# EAGLE schematic VET6_POD (EAGLE 4.13)
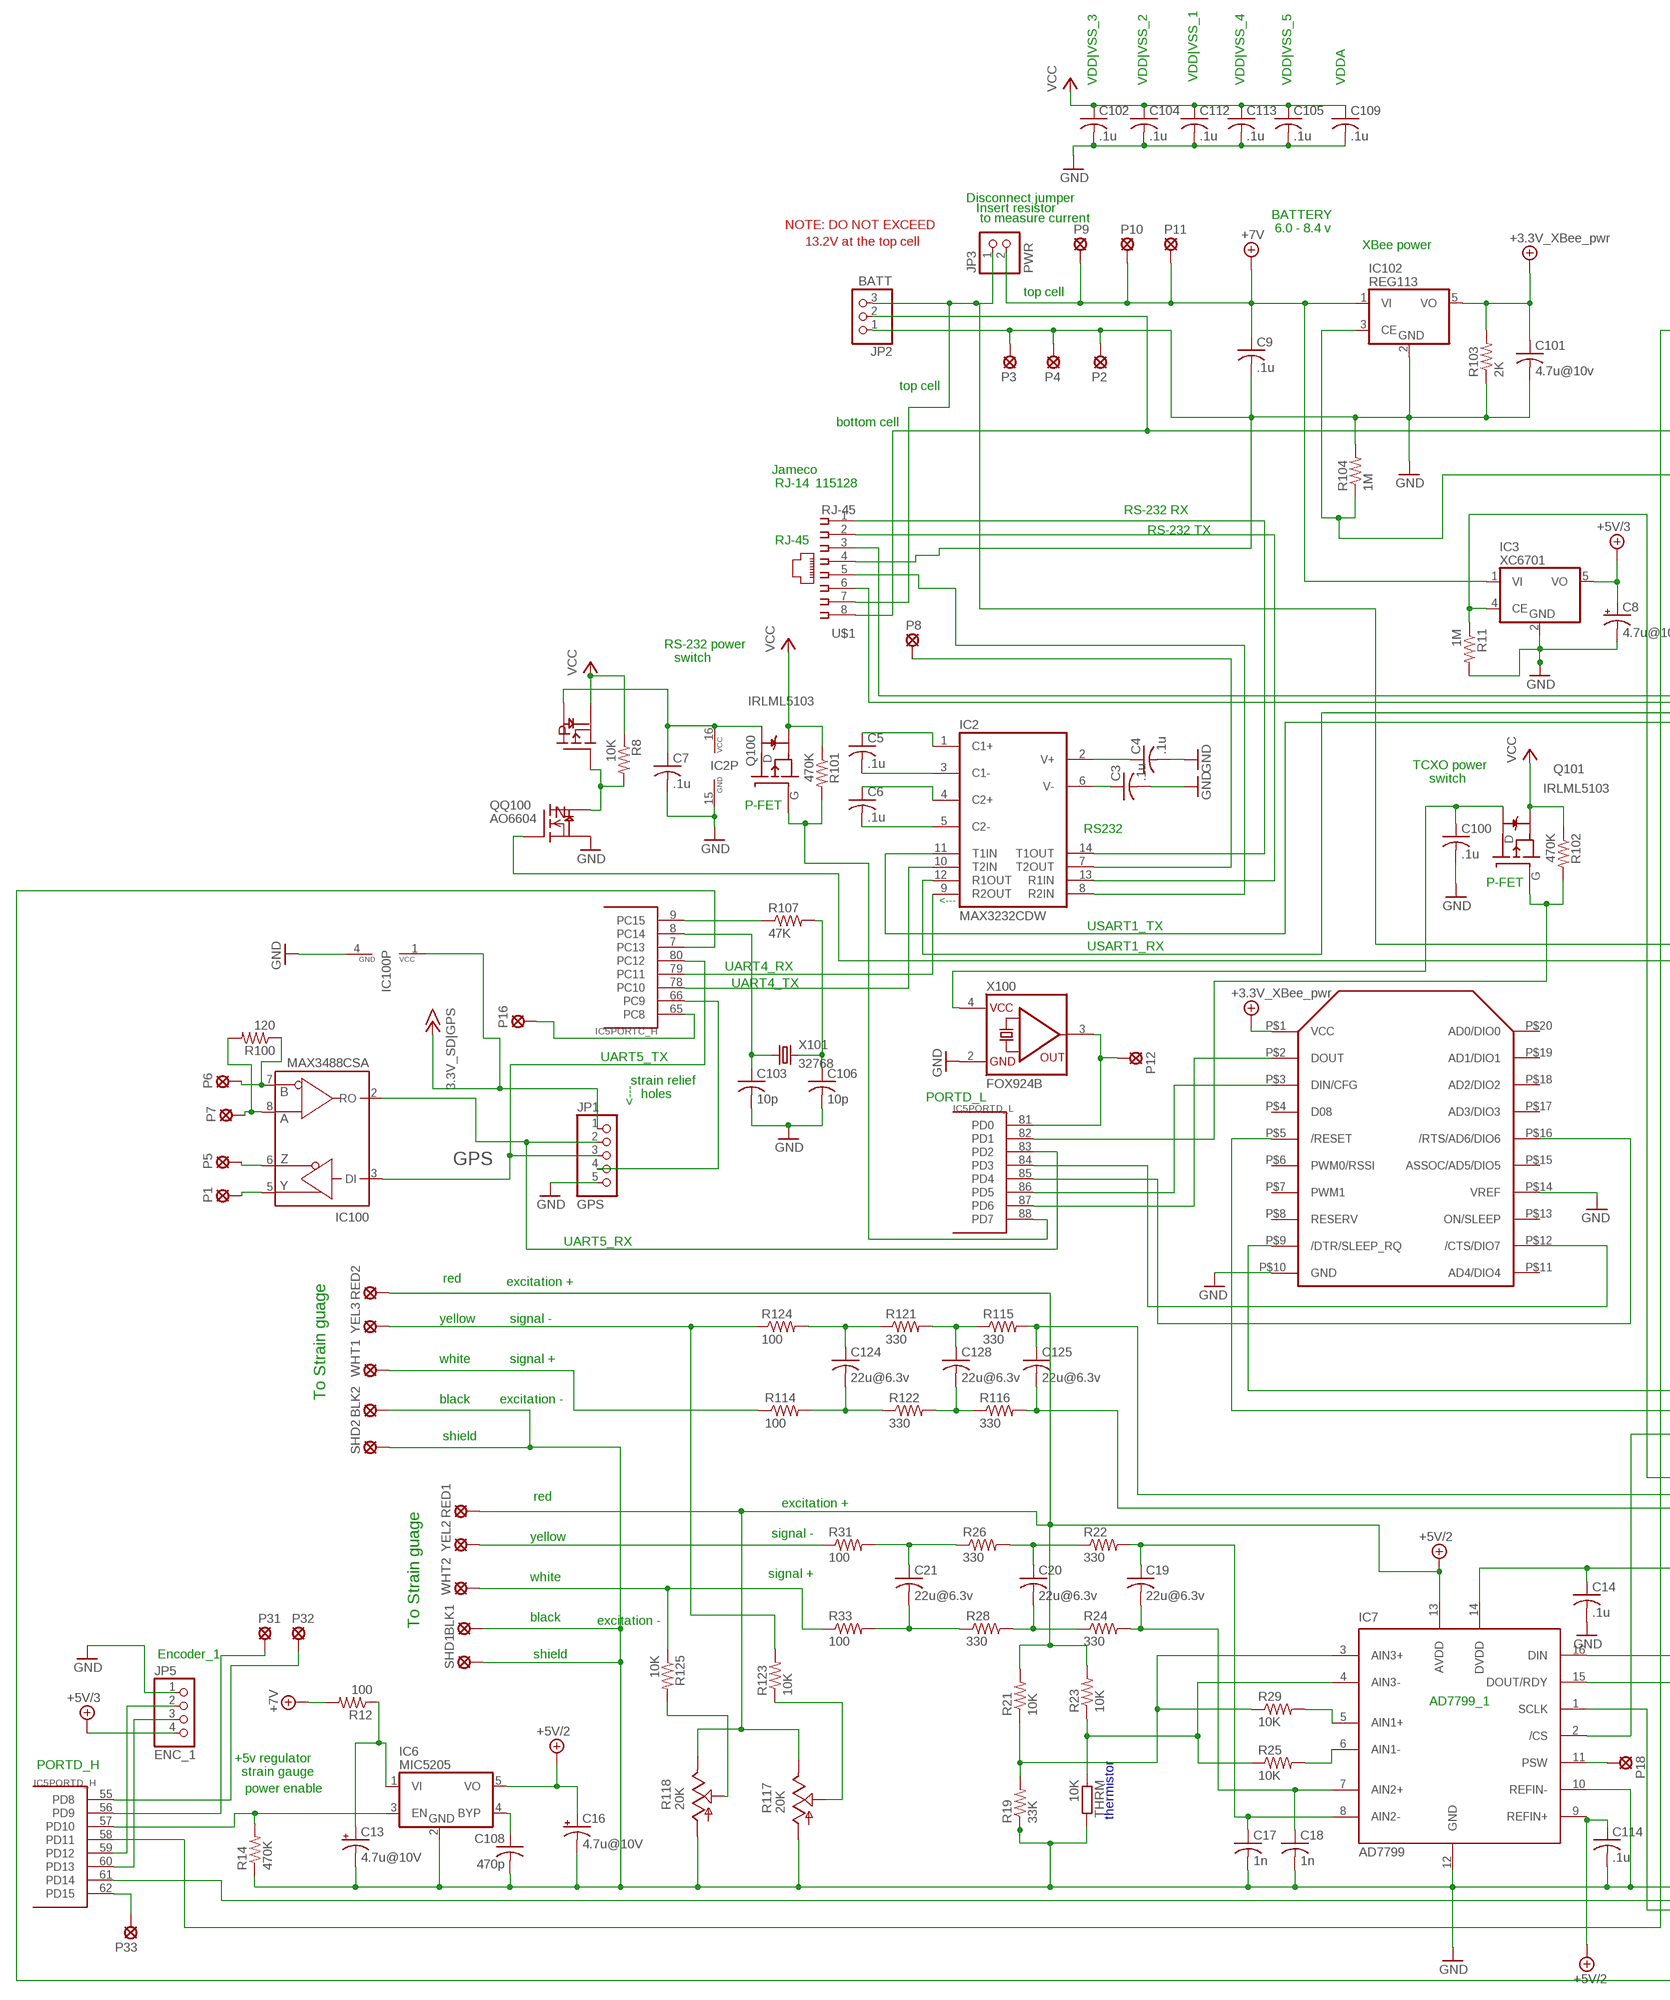
[diagram p0: schematic, sheet 1, part 1 of 2]
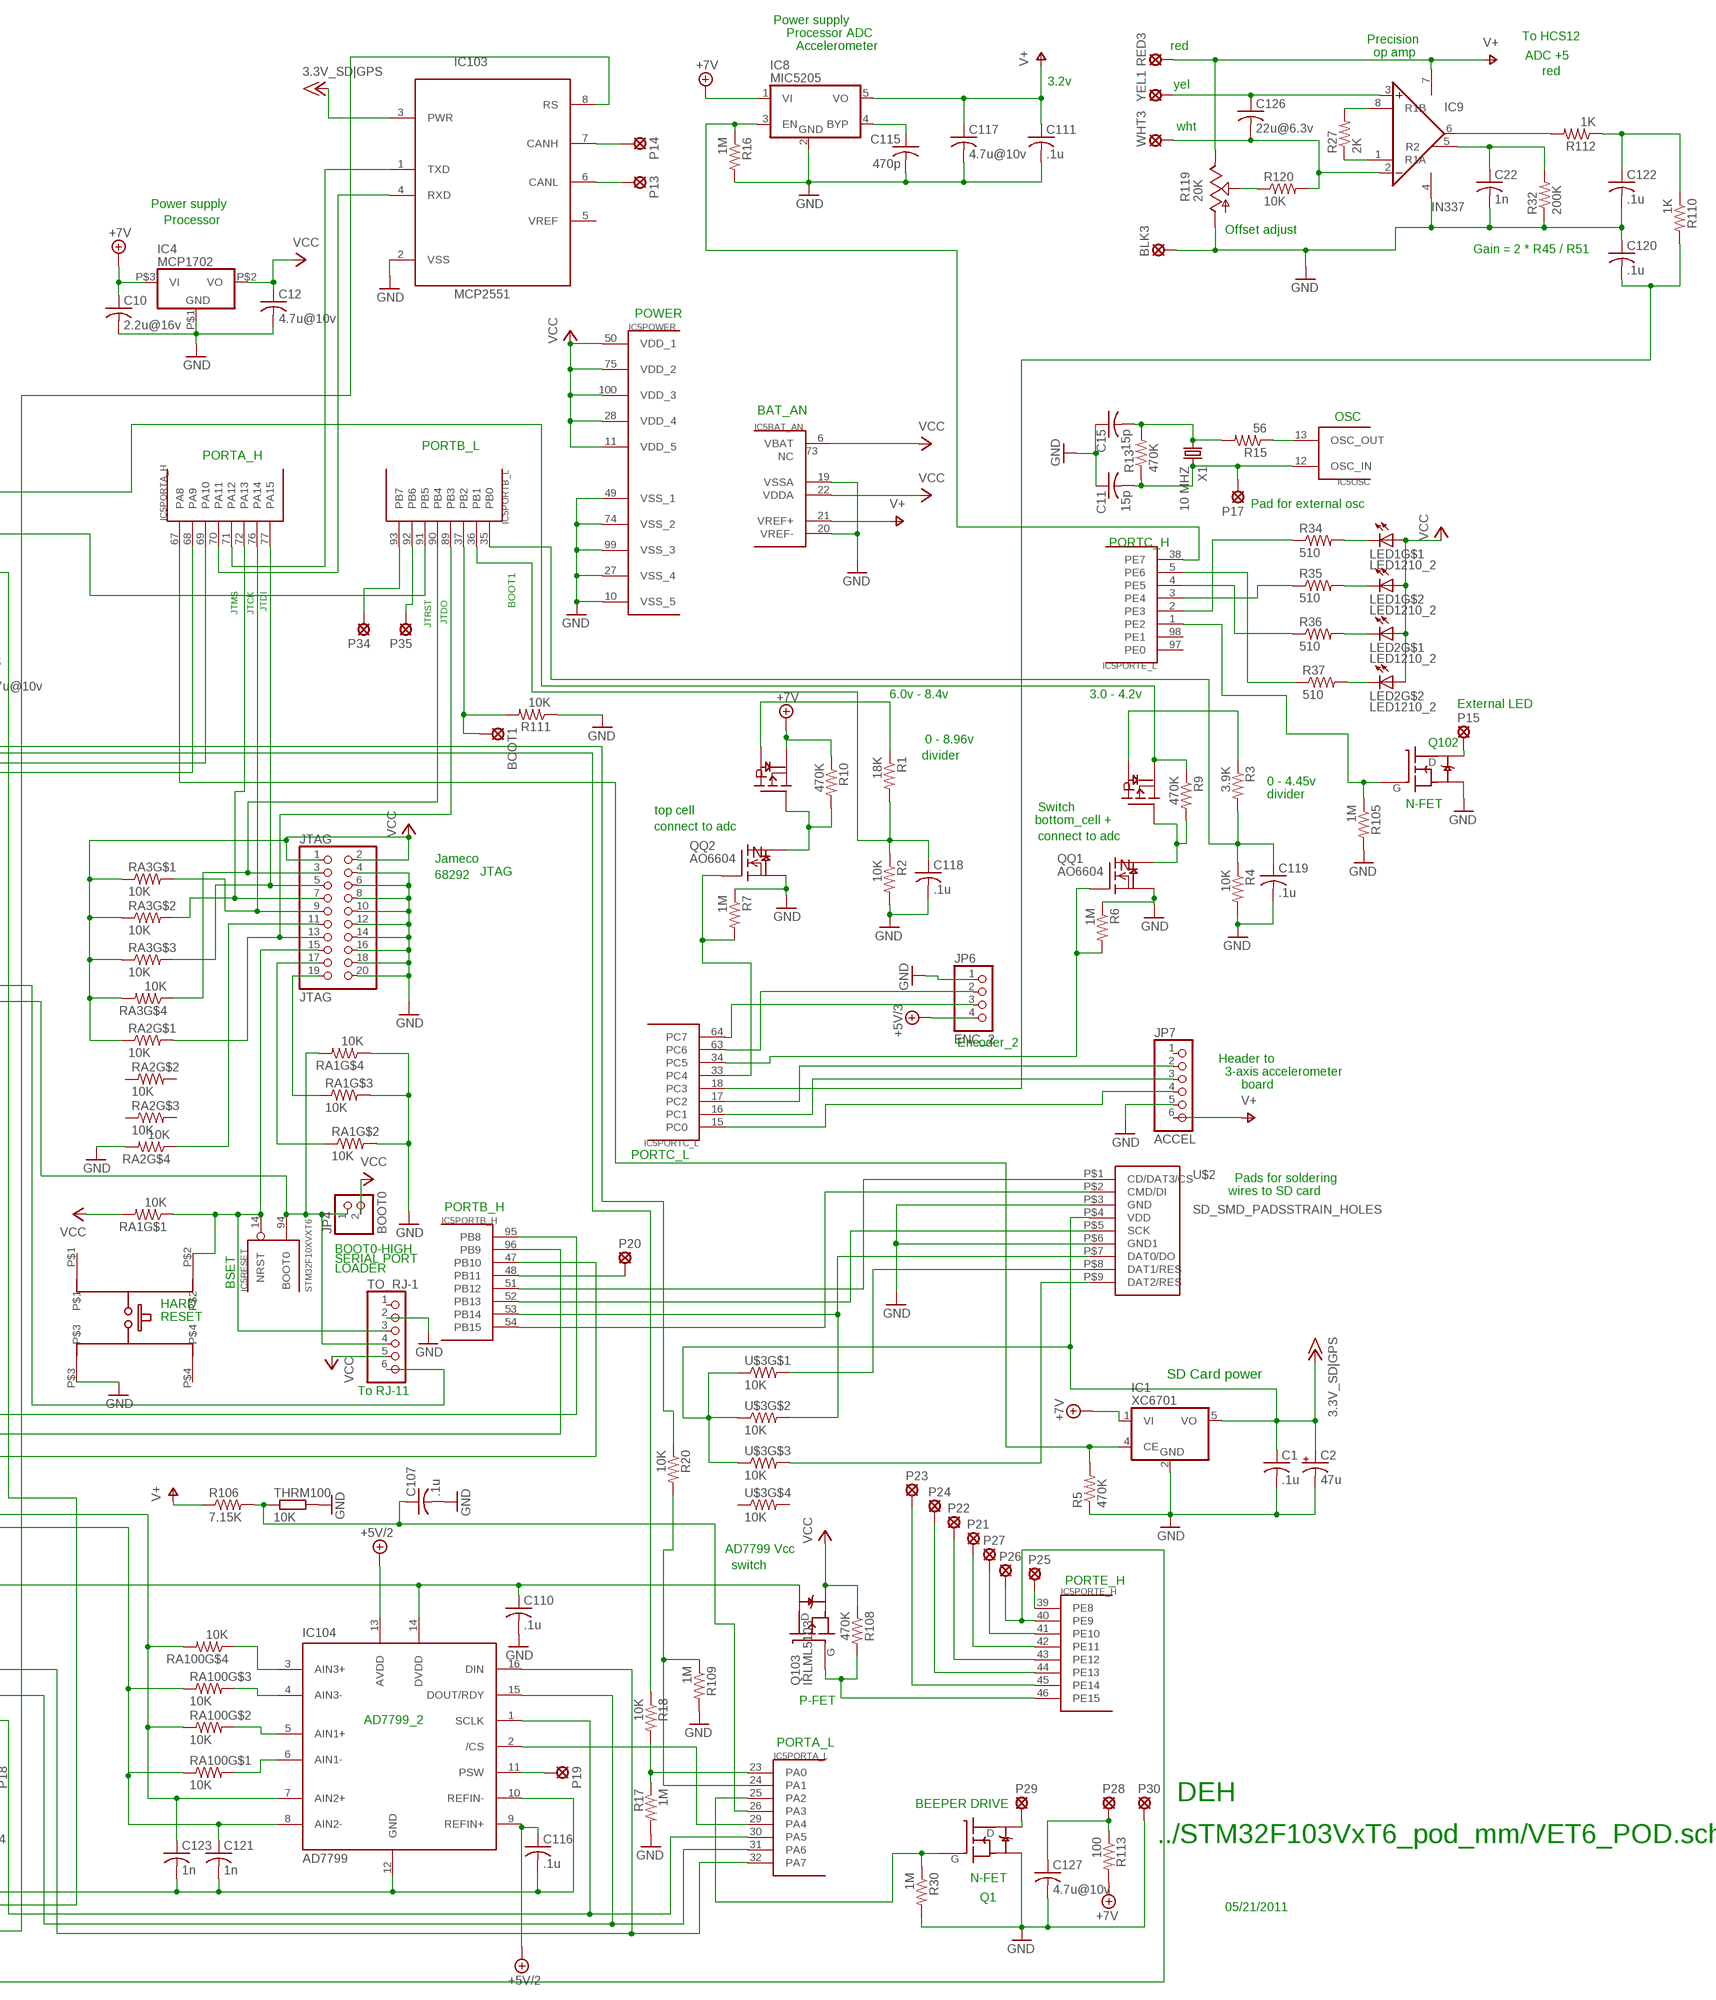
[diagram p1: schematic, sheet 1, part 2 of 2]

## Parts
BLK1  SOLPAD060  [SOLPAD060]
BLK2  SOLPAD060  [SOLPAD060]
BLK3  SOLPAD060  [SOLPAD060]
BOOT1  BOOT1  SOLDPAD028  [SOLPAD028]
C1  .1u  C-USC0805  [C0805]
C2  47u  CPOL-USCT3528  [CT3528]
C3  .1u  C-USC0805  [C0805]
C4  .1u  C-USC0805  [C0805]
C5  .1u  C-USC0805  [C0805]
C6  .1u  C-USC0805  [C0805]
C7  .1u  C-USC0805  [C0805]
C8  4.7u@10v  CPOL-USCT3528  [CT3528]
C9  .1u  C-USC0805  [C0805]
C10  2.2u@16v  C-USC0603  [C0603]
C11  15p  C-USC0603  [C0603]
C12  4.7u@10v  C-USC0805  [C0805]
C13  4.7u@10V  CPOL-USCT3528  [CT3528]
C14  .1u  C-USC0805  [C0805]
C15  15p  C-USC0603  [C0603]
C16  4.7u@10V  CPOL-USCT3528  [CT3528]
C17  1n  C-USC0603  [C0603]
C18  1n  C-USC0603  [C0603]
C19  22u@6.3v  C-USC1206  [C1206]
C20  22u@6.3v  C-USC1206  [C1206]
C21  22u@6.3v  C-USC1206  [C1206]
C22  1n  C-USC0603  [C0603]
C100  .1u  C-USC0805  [C0805]
C101  4.7u@10v  C-USC1206  [C1206]
C102  .1u  C-USC0805  [C0805]
C103  10p  C-USC0603  [C0603]
C104  .1u  C-USC0805  [C0805]
C105  .1u  C-USC0805  [C0805]
C106  10p  C-USC0603  [C0603]
C107  .1u  C-USC0805  [C0805]
C108  470p  C-USC0603  [C0603]
C109  .1u  C-USC0805  [C0805]
C110  .1u  C-USC0805  [C0805]
C111  .1u  C-USC0805  [C0805]
C112  .1u  C-USC0805  [C0805]
C113  .1u  C-USC0805  [C0805]
C114  .1u  C-USC0603  [C0603]
C115  470p  C-USC0603  [C0603]
C116  .1u  C-USC0603  [C0603]
C117  4.7u@10v  C-USC1206  [C1206]
C118  .1u  C-USC0805  [C0805]
C119  .1u  C-USC0805  [C0805]
C120  .1u  C-USC0805  [C0805]
C121  1n  C-USC0603  [C0603]
C122  .1u  C-USC0805  [C0805]
C123  1n  C-USC0603  [C0603]
C124  22u@6.3v  C-USC1206  [C1206]
C125  22u@6.3v  C-USC1206  [C1206]
C126  22u@6.3v  C-USC1206  [C1206]
C127  4.7u@10v  C-USC1206  [C1206]
C128  22u@6.3v  C-USC1206  [C1206]
IC1  XC6701  [SOT-25]
IC2  MAX3232CDW  MAX232ECWE  [SO16L]
IC3  XC6701  [SOT-25]
IC4  MCP1702  [SOT-23A]
IC5  STM32F10XVXT6  [TQFP100]
IC6  MIC5205  [SOT-25]
IC7  AD7799  [TSSPO16]
IC8  MIC5205  [SOT-25]
IC9  IN337  [SO08]
IC100  MAX3488CSA  MAX488CSA  [SO08]
IC101  XBEE-PROSMD  [XBEE_PRO_SMD]
IC102  REG113  [SOT-25]
IC103  MCP2551  [SO-08]
IC104  AD7799  [TSSPO16]
JP1  GPS  PINHD-1X5  [1X05]
JP2  BATT  PINHD-1X3  [1X03]
JP3  PWR  PINHD-1X2  [1X02]
JP4  BOOT0  PINHD-1X2  [1X02]
JP5  ENC_1  PINHD-1X4  [1X04]
JP6  ENC_2  PINHD-1X4  [1X04]
JP7  ACCEL  PINHD-1X6  [1X06]
JTAG  JTAG  PINHD-2X10_KEYED  [2X10_KEYED]
LED1  LED1210_2  [CHIP2LED_1210]
LED2  LED1210_2  [CHIP2LED_1210]
P1  P9  SOLPAD035  [SOLDPAD035]
P2  GND  SOLPAD035  [SOLDPAD035]
P3  GND  SOLPAD035  [SOLDPAD035]
P4  GND  SOLPAD035  [SOLDPAD035]
P5  P9  SOLPAD035  [SOLDPAD035]
P6  P9  SOLPAD035  [SOLDPAD035]
P7  P9  SOLPAD035  [SOLDPAD035]
P8  P9  SOLPAD035  [SOLDPAD035]
P9  +7V  SOLPAD035  [SOLDPAD035]
P10  +7V  SOLPAD035  [SOLDPAD035]
P11  +7V  SOLPAD035  [SOLDPAD035]
P12  PD0  SOLPAD035  [SOLDPAD035]
P13  +7V  SOLPAD035  [SOLDPAD035]
P14  +7V  SOLPAD035  [SOLDPAD035]
P15  PE2_FET  SOLPAD035  [SOLDPAD035]
P16  PC8  SOLPAD035  [SOLDPAD035]
P17  OSC_IN  SOLPAD035  [SOLDPAD035]
P18  PSW_1  SOLPAD035  [SOLDPAD035]
P19  PSW_2  SOLPAD035  [SOLDPAD035]
P20  SOLDPAD028  [SOLPAD028]
P21  PE11  SOLDPAD028  [SOLPAD028]
P22  PE12  SOLDPAD028  [SOLPAD028]
P23  PE14  SOLDPAD028  [SOLPAD028]
P24  PE13  SOLDPAD028  [SOLPAD028]
P25  PE8  SOLDPAD028  [SOLPAD028]
P26  PE9  SOLDPAD028  [SOLPAD028]
P27  PE10  SOLDPAD028  [SOLPAD028]
P28  +7V  SOLPAD035  [SOLDPAD035]
P29  BEEP  SOLPAD035  [SOLDPAD035]
P30  +7V  SOLPAD035  [SOLDPAD035]
P31  SOLPAD028  SOLDPAD028  [SOLPAD028]
P32  SOLPAD028  SOLDPAD028  [SOLPAD028]
P33  SOLPAD0.6  [SOLPAD0.6]
P34  SOLPAD0.6  [SOLPAD0.6]
P35  SOLPAD0.6  [SOLPAD0.6]
Q1  IRLML2060  [SOT-23]
Q100  IRLML5103  [SOT-23]
Q101  IRLML5103  [SOT-23]
Q102  IRLML2060  [SOT-23]
Q103  IRLML5103  [SOT-23]
QQ1  AO6604  [TSOP6]
QQ2  AO6604  [TSOP6]
QQ100  AO6604  [TSOP6]
R1  18K  R-US_M0805  [M0805]
R2  10K  R-US_M0805  [M0805]
R3  3.9K  R-US_M0805  [M0805]
R4  10K  R-US_M0805  [M0805]
R5  470K  R-US_R0603  [R0603]
R6  1M  R-US_R0603  [R0603]
R7  1M  R-US_R0603  [R0603]
R8  10K  R-US_R0603  [R0603]
R9  470K  R-US_R0603  [R0603]
R10  470K  R-US_R0603  [R0603]
R11  1M  R-US_R0603  [R0603]
R12  100  R-US_R0603  [R0603]
R13  470K  R-US_R0603  [R0603]
R14  470K  R-US_R0603  [R0603]
R15  56  R-US_M0805  [M0805]
R16  1M  R-US_R0603  [R0603]
R17  1M  R-US_M0805  [M0805]
R18  10K  R-US_M0805  [M0805]
R19  33K  R-US_R0603  [R0603]
R20  10K  R-US_M0805  [M0805]
R21  10K  R-US_R0603  [R0603]
R22  330  R-US_R0603  [R0603]
R23  10K  R-US_R0603  [R0603]
R24  330  R-US_R0603  [R0603]
R25  10K  R-US_R0603  [R0603]
R26  330  R-US_R0603  [R0603]
R27  2K  R-US_R0603  [R0603]
R28  330  R-US_R0603  [R0603]
R29  10K  R-US_R0603  [R0603]
R30  1M  R-US_M0805  [M0805]
R31  100  R-US_R0603  [R0603]
R32  200K  R-US_R0603  [R0603]
R33  100  R-US_R0603  [R0603]
R34  510  R-US_R0603  [R0603]
R35  510  R-US_R0603  [R0603]
R36  510  R-US_R0603  [R0603]
R37  510  R-US_R0603  [R0603]
R100  120  R-US_R0603  [R0603]
R101  470K  R-US_R0603  [R0603]
R102  470K  R-US_R0603  [R0603]
R103  2K  R-US_R0603  [R0603]
R104  1M  R-US_R0603  [R0603]
R105  1M  R-US_M0805  [M0805]
R106  7.15K  R-US_M0805  [M0805]
R107  47K  R-US_M0805  [M0805]
R108  470K  R-US_R0603  [R0603]
R109  1M  R-US_M0805  [M0805]
R110  1K  R-US_R0603  [R0603]
R111  10K  R-US_R0603  [R0603]
R112  1K  R-US_R0603  [R0603]
R113  100  R-US_M0805  [M0805]
R114  100  R-US_R0603  [R0603]
R115  330  R-US_R0603  [R0603]
R116  330  R-US_R0603  [R0603]
R117  20K  TRIM_US-  [SM42X]
R118  20K  TRIM_US-  [SM42X]
R119  20K  TRIM_US-  [SM42X]
R120  10K  R-US_R0603  [R0603]
R121  330  R-US_R0603  [R0603]
R122  330  R-US_R0603  [R0603]
R123  10K  R-US_M0805  [M0805]
R124  100  R-US_R0603  [R0603]
R125  10K  R-US_M0805  [M0805]
RA1  10K  REXB-38V  [EXB-38]
RA2  10K  REXB-38V  [EXB-38]
RA3  10K  REXB-38V  [EXB-38]
RA100  10K  REXB-38V  [EXB-38]
RED1  SOLPAD060  [SOLPAD060]
RED2  SOLPAD060  [SOLPAD060]
RED3  SOLPAD060  [SOLPAD060]
SHD1  SOLPAD060  [SOLPAD060]
SHD2  SOLPAD060  [SOLPAD060]
SW100  E-SWITCH  [E-SWITCH]
THRM  10K  R-EU_R0603  [R0603]
THRM100  10K  R-EU_R0603  [R0603]
TO_RJ-1  PINHD-1X6  [1X06]
U$1  RJ-45  8P8CJACK  [8P8C]
U$2  SD_SMD_PADSSTRAIN_HOLES  [SD_CARD_SMD_PADS_STRAIN_HOLES]
U$3  10K  REXB-38V  [EXB-38]
WHT1  SOLPAD060  [SOLPAD060]
WHT2  SOLPAD060  [SOLPAD060]
WHT3  SOLPAD060  [SOLPAD060]
X1  10 MHZ  CRYTALHC49UP  [HC49UP]
X100  FOX924B  [FOX924B_TCXO]
X101  32768  CRYTAL  [TC26H_SMD]
YEL1  SOLPAD060  [SOLPAD060]
YEL2  SOLPAD060  [SOLPAD060]
YEL3  SOLPAD060  [SOLPAD060]

## Nets
3.3V_SD_CARD|GPS: C1.1 C2.+ IC1.5(VO) IC100.1(VCC) IC103.3(PWR) JP1.1 U$2.P$4(VDD) U$3.P$1 U$3.P$2 U$3.P$3 ; supply symbol labelled 3.3V_SD|GPS
3.3V_TXCO+SUPPLY: C100.1 Q101.3(D) X100.4(VCC)
+3.3V/XB: C101.1 IC101.P$1(VCC) IC102.5(VO) R103.2 ; supply symbol labelled +3.3V_XBee_pwr
+5V/2: C16.+ C114.1 C116.1 IC6.5(VO) IC7.9(REFIN+) IC7.13(AVDD) IC104.9(REFIN+) IC104.13(AVDD) R21.2 R23.2 R117.E R118.E RED1.MP RED2.MP
+5V/3: C8.+ IC3.5(VO) JP5.4 JP6.4
+7V: C9.1 C10.1 IC1.1(VI) IC3.1(VI) IC4.P$3(VI) IC8.1(VI) IC102.1(VI) JP3.2 P9.MP P10.MP P11.MP QQ2.P$2(S2) R10.1 R12.2 R113.2
+7V_VIA_RESISTOR: C13.+ IC6.1(VI) R12.1
AD7799_1_AIN1+: IC7.5(AIN1+) R29.2
AD7799_1_AIN1-: IC7.6(AIN1-) R25.2
AD7799_1_AIN3+: IC7.3(AIN3+) R19.2 R21.1 R29.1
AD7799_1|PAD: IC7.11(PSW) P18.MP
AD7799_2_AIN1+: IC104.5(AIN1+) RA100.P$7
AD7799_2_AIN1-: IC104.6(AIN1-) RA100.P$8
AD7799_2_AIN3+: IC104.3(AIN3+) RA100.P$5
AD7799_2_AIN3-: IC104.4(AIN3-) RA100.P$6
AD7799_2|PAD: IC104.11(PSW) P19.MP
ADC_IN13|OP_AMP_OUT_FILTERED: C120.2 IC5.18(PORTC_L:PC3) R110.2
ADS7799_1_AIN3-: IC7.4(AIN3-) R23.1 R25.1 THRM.1
BOOT0: IC5.94(RESET:BOOT0) JP4.1 QQ100.P$1(G1) RA1.P$4 TO_RJ-1.4
BOT_CELL_N-DRAIN_P-GATE: QQ1.P$3(G2) QQ1.P$6(D1) R9.2
BRDIGE1_YELLOW_AIN1-: C17.1 C19.1 IC7.8(AIN2-) R22.2
BRDIGE2_YELLOW_AIN1+: C123.1 C125.1 IC104.7(AIN2+) R115.2 RA100.P$2 RA100.P$4
BRIDGE1_FILTER+_1: C21.2 R28.1 R33.2
BRIDGE1_FILTER+_2: C20.2 R24.1 R28.2
BRIDGE1_FILTER-_1: C21.1 R26.1 R31.2
BRIDGE1_FILTER-_2: C20.1 R22.1 R26.2
BRIDGE1_WHITE_AIN2+: C18.1 C19.2 IC7.7(AIN2+) R24.2
BRIDGE1_WHITE_SIG+: R33.1 R125.1 WHT2.MP
BRIDGE1_YELLOW_SIG-: R31.1 YEL2.MP
BRIDGE2_FILTER+_1: C124.2 R114.2 R122.1
BRIDGE2_FILTER+_2: C128.2 R116.1 R122.2
BRIDGE2_FILTER-_1: C124.1 R121.1 R124.2
BRIDGE2_FILTER-_2: C128.1 R115.1 R121.2
BRIDGE2_WHITE_AIN1-: C121.1 C125.2 IC104.8(AIN2-) R116.2 RA100.P$1 RA100.P$3
BRIDGE2_WHITE_SIG+: R114.1 WHT1.MP
BRIDGE2_YELLOW_SIG-: R123.2 R124.1 YEL3.MP
BRIDGE_WHITE: C126.2 IC9.2(-IN) R120.2 WHT3.MP
BRIDGE_YELLOW: C126.1 IC9.3(+IN) YEL1.MP
C1+: C5.1 IC2.1(C1+)
C1-: C5.2 IC2.3(C1-)
C2+: C6.1 IC2.4(C2+)
C2-: C6.2 IC2.5(C2-)
GND: BLK1.MP BLK2.MP BLK3.MP C1.2 C2.- C3.2 C4.2 C7.2 C8.- C9.2 C10.2 C11.1 C12.2 C13.- C14.2 C15.1 C16.- C17.2 C18.2 C22.2 C100.2 C101.2 C102.2 C103.2 C104.2 C105.2 C106.2 C107.2 C108.2 C109.2 C110.2 C111.2 C112.2 C113.2 C114.2 C115.2 C116.2 C117.2 C118.2 C119.2 C120.1 C121.2 C122.2 C123.2 C127.2 IC1.2(GND) IC2.15(GND) IC3.2(GND) IC4.P$1(GND) IC5.10(POWER:VSS_5) IC5.19(BAT_AN:VSSA) IC5.20(BAT_AN:VREF-) IC5.27(POWER:VSS_4) IC5.49(POWER:VSS_1) IC5.74(POWER:VSS_2) IC5.99(POWER:VSS_3) IC6.2(GND) IC7.10(REFIN-) IC7.12(GND) IC8.2(GND) IC9.4(V-) IC100.4(GND) IC101.P$10(GND) IC101.P$14(VREF) IC102.2(GND) IC103.2(VSS) IC104.10(REFIN-) IC104.12(GND) JP1.5 JP2.1 JP5.1 JP6.1 JP7.5 JTAG.4 JTAG.6 JTAG.8 JTAG.10 JTAG.12 JTAG.14 JTAG.16 JTAG.18 JTAG.20 P2.MP P3.MP P4.MP P30.MP Q1.2(S) Q102.2(S) QQ1.P$5(S1) QQ2.P$5(S1) QQ100.P$5(S1) R2.2 R4.2 R5.1 R6.1 R7.1 R11.2 R14.1 R16.2 R17.2 R19.1 R30.2 R32.1 R103.1 R104.2 R105.2 R109.2 R111.1 R117.A R118.A R119.A RA1.P$5 RA1.P$6 RA1.P$7 RA2.P$4 SHD1.MP SHD2.MP SW100.P$3 THRM100.2 THRM.2 TO_RJ-1.2 U$1.4 U$2.P$3(GND) U$2.P$6(GND1) X100.2(GND)
IC6_BYP: C108.1 IC6.4(BYP)
IC8_BYP: C115.1 IC8.4(BYP)
JTAG_R-TO-GND-11: JTAG.11 RA2.P$5
JTAG_R-TO-GND-17: JTAG.17 RA1.P$2
JTAG_R-TO-GND-19: JTAG.19 RA1.P$3
JTCK: IC5.76(PORTA_H:PA14) JTAG.9 RA3.P$8
JTDI: IC5.77(PORTA_H:PA15) JTAG.5 RA3.P$6
JTDO: IC5.89(PORTB_L:PB3) JTAG.13 RA2.P$8
JTIMS: IC5.72(PORTA_H:PA13) JTAG.7 RA3.P$7
JTRST: IC5.90(PORTB_L:PB4) JTAG.3 RA3.P$5
MAX3232_DUAL_FET: QQ100.P$3(G2) QQ100.P$6(D1) R8.2
MAX3232_VCC: C7.1 IC2.16(VCC) Q100.3(D) QQ100.P$4(D2)
NRST: IC5.14(RESET:NRST) JTAG.15 RA1.P$1 SW100.P$2 TO_RJ-1.3
OP-AMP_ADJ: R119.S R120.1
OP_AMP_FB_1: IC9.1(R1A) R27.1
OP_AMP_FB_8: IC9.8(R1B) R27.2
OP_AMP_GAIN: C22.1 IC9.5(R2) R32.2
OP_AMP_OUT: IC9.6(OUT) R112.2
OP_AMP_OUT_1ST_RC: C122.1 R110.1 R112.1
OSC_IN: C11.2 IC5.12(OSC:OSC_IN) P17.MP R13.1 X1.2
OSC_OUT: IC5.13(OSC:OSC_OUT) R15.1
OSC_OUT_XTAL: C15.2 R13.2 R15.2 X1.1
P1_RS485_Y: IC100.5(Y) P1.MP
P5-RS485_Z: IC100.6(Z) P5.MP
P6_RS485_B: IC100.7(B) P6.MP R100.1
P7_RS485_A: IC100.8(A) P7.MP R100.2
P13_CANL: IC103.6(CANL) P13.MP
P14_CANH: IC103.7(CANH) P14.MP
P15_FET_DRAIN: P15.MP Q102.3(D)
P28_+7V_VIA_R: C127.1 P28.MP R113.1
P29_BEEP_FET_DRAIN: P29.MP Q1.3(D)
P_FET_DRAIN_SWITCHED_BOTTOMCELL: QQ1.P$4(D2) R3.1
P_FET_DRAIN_SWITCHED_TOPCELL: QQ2.P$4(D2) R1.1
PA0_WKUP: IC5.23(PORTA_L:PA0) R17.1 R18.2
PA0_WKUP|RJ-45: R18.1 U$1.6
PA1_SPARE: IC5.24(PORTA_L:PA1) R20.2 R109.1
PA1|RJ-45_SPARE: R20.1 U$1.3
PA2_TIM2_CH2|BEEP_FET: IC5.25(PORTA_L:PA2) Q1.1(G) R30.1
PA3_ADC123_IN3|THERMISTOR_32KHZ: C107.1 IC5.26(PORTA_L:PA3) R106.2 THRM100.1
PA5_SPI1_SCK_AD7799_SCK: IC5.30(PORTA_L:PA5) IC7.1(SCLK) IC104.1(SCLK)
PA6_SPI1_MISO_AD7799_DOUT/RDY: IC5.31(PORTA_L:PA6) IC7.15(DOUT/RDY) IC104.15(DOUT/RDY)
PA7_SPI1_MOSI_AD7799_DIN: IC5.32(PORTA_L:PA7) IC7.16(DIN) IC104.16(DIN)
PA8_GPIO|SD_CARD_REG_ENABLE: IC1.4(CE) IC5.67(PORTA_H:PA8) R5.2
PA9_USART1_TX: IC2.11(T1IN) IC5.68(PORTA_H:PA9)
PA10_USART1_RX: IC2.12(R1OUT) IC5.69(PORTA_H:PA10)
PA11_CAN_RX|CAN_RXD: IC5.70(PORTA_H:PA11) IC103.4(RXD)
PA12_CAN_TX|CAN_TXD: IC5.71(PORTA_H:PA12) IC103.1(TXD)
PB0_ADC_IN8|BOTTOM_CELL: C119.1 IC5.35(PORTB_L:PB0) R3.2 R4.1
PB1_ADC8|BOTTOM_CELL: JP2.2 QQ1.P$2(S2) R9.1 U$1.8
PB1_ADC_IN9|TOP_CELL: C118.1 IC5.36(PORTB_L:PB1) R1.2 R2.1
PB2_BOOT1: BOOT1.MP IC5.37(PORTB_L:PB2) R111.2
PB5_GPIO|XBEE_REG_CE: IC5.91(PORTB_L:PB5) IC102.3(CE) R104.1
PB6: IC5.92(PORTB_L:PB6) P35.MP
PB7: IC5.93(PORTB_L:PB7) P34.MP
PB8_GPIO|XB_DTR/SLEEP_RQ: IC5.95(PORTB_H:PB8) IC101.P$9(/DTR/SLEEP_RQ)
PB9_GPIO|XB_/RESET: IC5.96(PORTB_H:PB9) IC101.P$5(/RESET)
PB10_GPIO|AD7799_1/CS: IC5.47(PORTB_H:PB10) IC7.2(/CS)
PB11_PAD: IC5.48(PORTB_H:PB11) P20.MP
PB12_SPI2_NSS|SD_CD: IC5.51(PORTB_H:PB12) U$2.P$1(CD/DAT3/CS)
PB13_SPI2_SCK|SD_SCK: IC5.52(PORTB_H:PB13) U$2.P$5(SCK)
PB14_SPI2_MISO|SD_DO: IC5.53(PORTB_H:PB14) U$2.P$7(DAT0/DO) U$3.P$7
PB15_SPI2_MOSI|SD_CMD_DI: IC5.54(PORTB_H:PB15) U$2.P$2(CMD/DI)
PC0_ADC12_IN11|X-AXIS: IC5.15(PORTC_L:PC0) JP7.4
PC1_ADC12_IN11|Y-AXIS: IC5.16(PORTC_L:PC1) JP7.3
PC2_ADC12_IN12|Z-AXIS: IC5.17(PORTC_L:PC2) JP7.2
PC4_GPIO|TOP_CELL_ENABLE: IC5.33(PORTC_L:PC4) QQ2.P$1(G1) R7.2
PC5_GPIO|BOTTOM_CELL_ENABLE: IC5.34(PORTC_L:PC5) QQ1.P$1(G1) R6.2
PC6_TIM3_CH1*|ENCODER_2_B: IC5.63(PORTC_L:PC6) JP6.2
PC7_TIM3_CH2*|ENCODER_2_A: IC5.64(PORTC_L:PC7) JP6.3
PC8: IC5.65(PORTC_H:PC8) P16.MP
PC9_TIM8_CH4|GPS_1PPS: IC5.66(PORTC_H:PC9) JP1.4
PC10_UART4_TX: IC2.10(T2IN) IC5.78(PORTC_H:PC10)
PC11_UART4_RX: IC2.9(R2OUT) IC5.79(PORTC_H:PC11)
PC12_USART5_TX|GPS_RX: IC5.80(PORTC_H:PC12) IC100.3(DI) JP1.3
PC14_OSC32IN|XTAL: C103.1 IC5.8(PORTC_H:PC14) X101.P$1
PC15_OSC32_OUT|DRIVE: IC5.9(PORTC_H:PC15) R107.1
PD0_OSC_IN|10MHZ_OSC: IC5.81(PORTD_L:PD0) P12.MP X100.3(OUT)
PD1_GPIO|TXCO_REG_EN: IC5.82(PORTD_L:PD1) Q101.1(G) R102.2
PD2_UART5_RX|GPS_TX: IC5.83(PORTD_L:PD2) IC100.2(RO) JP1.2
PD3_USART2_CTS*|XB_/CTS: IC5.84(PORTD_L:PD3) IC101.P$12(/CTS/DIO7)
PD4_USART2_RTS*|XB_/RTS: IC5.85(PORTD_L:PD4) IC101.P$16(/RTS/AD6/DIO6)
PD5_USART2_TX*|XB_DIN: IC5.86(PORTD_L:PD5) IC101.P$3(DIN/CFG)
PD6_USART2_RX*|XB_DOUT: IC5.87(PORTD_L:PD6) IC101.P$2(DOUT)
PD7_GPIO|MAX3232_VCC: IC5.88(PORTD_L:PD7) Q100.1(G) R101.2
PD9_USART3_RX*|P31: IC5.56(PORTD_H:PD9) P31.MP
PD9_USART3_TX*|P32: IC5.55(PORTD_H:PD8) P32.MP
PD10_5V/2_ANALOG_CE: IC5.57(PORTD_H:PD10) IC6.3(EN) R14.2
PD11_GPIO|CAN_RS: IC5.58(PORTD_H:PD11) IC103.8(RS)
PD12_TIM4_CH1*|ENCODER_B: IC5.59(PORTD_H:PD12) JP5.2
PD13_TIME4_CH2*|ENCODER_A: IC5.60(PORTD_H:PD13) JP5.3
PD14_GPIO|5V_EN_ENCODERS&GPS: IC3.4(CE) IC5.61(PORTD_H:PD14) R11.1
PD15: IC5.62(PORTD_H:PD15) P33.MP
PE2_GPIO|EXT_LED_FET_G: IC5.1(PORTE_L:PE2) Q102.1(G) R105.1
PE3: IC5.2(PORTE_L:PE3) R34.1
PE3_LED1: LED1.C R34.2
PE4: IC5.3(PORTE_L:PE4) R35.1
PE4_LED2: LED1.C1(C) R35.2
PE5: IC5.4(PORTE_L:PE5) R36.1
PE5_LED1: LED2.C R36.2
PE6: IC5.5(PORTE_L:PE6) R37.1
PE6_LED2: LED2.C1(C) R37.2
PE7__GPIO|3.3V_REG_EN_ANALOG: IC5.38(PORTE_L:PE7) IC8.3(EN) R16.1
PE8: IC5.39(PORTE_H:PE8) P25.MP
PE9-PC13: IC5.7(PORTC_H:PC13) IC5.40(PORTE_H:PE9) P26.MP
PE10: IC5.41(PORTE_H:PE10) P27.MP
PE11: IC5.42(PORTE_H:PE11) P21.MP
PE12: IC5.43(PORTE_H:PE12) P22.MP
PE13: IC5.44(PORTE_H:PE13) P24.MP
PE14: IC5.45(PORTE_H:PE14) P23.MP
PE15_GPIO|AD7799_VCC_SW: IC5.46(PORTE_H:PE15) Q103.1(G) R108.2
PPC9_GPIO|AD7799_2_/CS: IC5.29(PORTA_L:PA4) IC104.2(/CS)
PULLUP_|SD_DAT1: U$2.P$8(DAT1/RES) U$3.P$8
PULLUP_|SD_DAT2: U$2.P$9(DAT2/RES) U$3.P$6
RJ-45|RS232_R2IN_UART4_RX: IC2.8(R2IN) U$1.5
RJ-45|T2OUT_UART4_TX: IC2.7(T2OUT) P8.MP
RS232_R1IN_USART1_RX: IC2.13(R1IN) U$1.2
T1OUT_USART1_TX: IC2.14(T1OUT) U$1.1
TOP_CELL_N-DRAIN_P-GATE: QQ2.P$3(G2) QQ2.P$6(D1) R10.2
TOP_CELL_RAW: JP2.3 JP3.1 TO_RJ-1.6 U$1.7
V+: C111.1 C117.1 IC5.21(BAT_AN:VREF+) IC8.5(VO) IC9.7(V+) JP7.6 R106.1 R119.E RED3.MP
VCC: C12.1 C102.1 C104.1 C105.1 C109.1 C112.1 C113.1 IC4.P$2(VO) IC5.6(BAT_AN:VBAT) IC5.11(POWER:VDD_5) IC5.22(BAT_AN:VDDA) IC5.28(POWER:VDD_4) IC5.50(POWER:VDD_1) IC5.75(POWER:VDD_2) IC5.100(POWER:VDD_3) JP4.2 JTAG.1 JTAG.2 LED1.A LED1.A1(A) LED2.A LED2.A1(A) Q100.2(S) Q101.2(S) Q103.2(S) QQ100.P$2(S2) R8.1 R101.1 R102.1 R108.1 RA1.P$8 RA2.P$1 RA3.P$1 RA3.P$2 RA3.P$3 RA3.P$4 TO_RJ-1.5
VCC_AD7799_SW: C14.1 C110.1 IC7.14(DVDD) IC104.14(DVDD) Q103.3(D)
VRS232+: C4.1 IC2.2(V+)
VRS232-: C3.1 IC2.6(V-)
WHT1_POT_WIPER: R118.S R125.2
WHT2_POT_WIPER: R117.S R123.1
XTAL_DRIVE: C106.1 R107.2 X101.P$2
Unconnected: IC5.73(BAT_AN:NC) IC5.97(PORTE_L:PE0) IC5.98(PORTE_L:PE1) IC101.P$4(D08) IC101.P$6(PWM0/RSSI) IC101.P$7(PWM1) IC101.P$8(RESERV) IC101.P$11(AD4/DIO4) IC101.P$13(ON/SLEEP) IC101.P$15(ASSOC/AD5/DIO5) IC101.P$17(AD3/DIO3) IC101.P$18(AD2/DIO2) IC101.P$19(AD1/DIO1) IC101.P$20(AD0/DIO0) IC103.5(VREF) JP7.1 RA2.P$2 RA2.P$3 RA2.P$6 RA2.P$7 SW100.P$1 SW100.P$4 TO_RJ-1.1 U$3.P$4 U$3.P$5

## Notes on the sheet
- Power supply
- Processor ADC | To HCS12
- Precision
- Accelerometer | red
- op amp | ADC +5
- red
- 3.2v | yel
- wht
- VDD|VSS_3 | VDD|VSS_2 | VDD|VSS_1 | VDD|VSS_4 | VDD|VSS_5 | VDDA
- Power supply
- Processor
- Offset adjust
- Gain = 2 * R45 / R51
- Disconnect jumper
- Insert resistor
- to measure current | BATTERY
- NOTE: DO NOT EXCEED | 6.0 - 8.4 v
- 13.2V at the top cell | XBee power | POWER
- top cell
- BAT_AN
- OSC
- top cell | PORTB_L
- PORTA_H
- bottom cell
- Pad for external osc
- Jameco
- RJ-14 | 115128 | PORTC_H
- RS-232 RX
- RS-232 TX
- RJ-45
- BOOT1
- JTDI
- JTMS | JTCK
- JTDO
- JTRST
- RS-232 power | 6.0v - 8.4v | 3.0 - 4.2v
- External LED
- switch
- 0 - 8.96v | Q102
- divider
- 0 - 4.45v
- divider
- Switch | N-FET
- TCXO power | top cell
- bottom_cell +
- switch | connect to adc
- connect to adc
- pre-charge switch
- P-FET
- Jameco
- RS232 | 68292 | JTAG
- P-FET
- <---
- USART1_TX
- USART1_RX
- UART4_RX
- UART4_TX
- Encoder_2
- Header to
- 3-axis accelerometer
- board
- UART5_TX
- strain relief
- holes | PORTD_L
- <---
- PORTC_L
- Pads for soldering
- GPS | wires to SD card
- PORTB_H
- BOOT0-HIGH
- SERIAL PORT
- UART5_RX | LOADER
- BSET
- red | HARD
- excitation +
- RESET
- yellow | signal -
- SD Card power
- white | signal +
- To RJ-11
- To Strain guage | black | excitation -
- shield
- red
- excitation +
- signal - | AD7799 Vcc
- yellow
- switch
- PORTE_H
- white | signal +
- black | excitation -
- To Strain guage
- Encoder_1 | shield
- P-FET
- AD7799_1
- AD7799_2
- PORTA_L
- +5v regulator
- PORTD_H
- strain gauge
- power enable | DEH
- BEEPER DRIVE
- thermistor
- ../STM32F103VxT6_pod_mm/VET6_POD.sch
- N-FET
- Q1
- 05/21/2011

## Library data of the parts
BLK1-BLK3 RED1-RED3 SHD1 SHD2 WHT1-WHT3 YEL1-YEL3 = solpad:SOLPAD060
BOOT1 P20-P27 P31 P32 = solpad:SOLDPAD028
C1 C3-C7 C9-C12 C14 C15 C17-C22 C100-C128 = rcl:C-US: CAPACITOR, American symbol
C2 C8 C13 C16 = rcl:CPOL-US: POLARIZED CAPACITOR, American symbol
IC1 IC3 = linear:XC6701
IC2 = MAXIM:MAX232ECWE: RS232 TRANSEIVER
IC4 = linear:MCP1702
IC5 = stm32:STM32F10XVXT6: STM32F101/103 100 pin LQFP
IC6 IC8 = linear:MIC5205
IC7 IC104 = texas:AD7799
IC9 = linear:IN337
IC100 = MAXIM:MAX488: RS485 TRANSEIVER
IC101 = DEH:XBEE-PRO
IC102 = linear:REG113
IC103 = texas:MCP2551
JP1 = pinhead:PINHD-1X5: PIN HEADER
JP2 = pinhead:PINHD-1X3: PIN HEADER
JP3 JP4 = pinhead:PINHD-1X2: PIN HEADER
JP5 JP6 = pinhead:PINHD-1X4: PIN HEADER
JP7 TO_RJ-1 = pinhead:PINHD-1X6: PIN HEADER
JTAG = pinhead:PINHD-2X10_KEYED
LED1 LED2 = led:LED1210_2
P1-P19 P28-P30 = solpad:SOLPAD035
P33-P35 = solpad:SOLPAD0.6
Q1 Q102 = transistor-fet:IRLML2060
Q100 Q101 Q103 = transistor-fet:IRLML5103
QQ1 QQ2 QQ100 = transistor-fet:AO6604
R1-R37 R100-R116 R120-R125 = rcl:R-US_: RESISTOR, American symbol
R117-R119 = pot:TRIM_US-: POTENTIOMETER
RA1-RA3 RA100 U$3 = rcl:REXB-38V
SW100 = switch-misc:E-SWITCH
THRM THRM100 = rcl:R-EU_: RESISTOR, European symbol
U$1 = con-amp:8P8CJACK
U$2 = DEH:SD_SMD_PADS
X1 X101 = crystal:CRYTAL: CRYSTAL
X100 = crystal:FOX924B